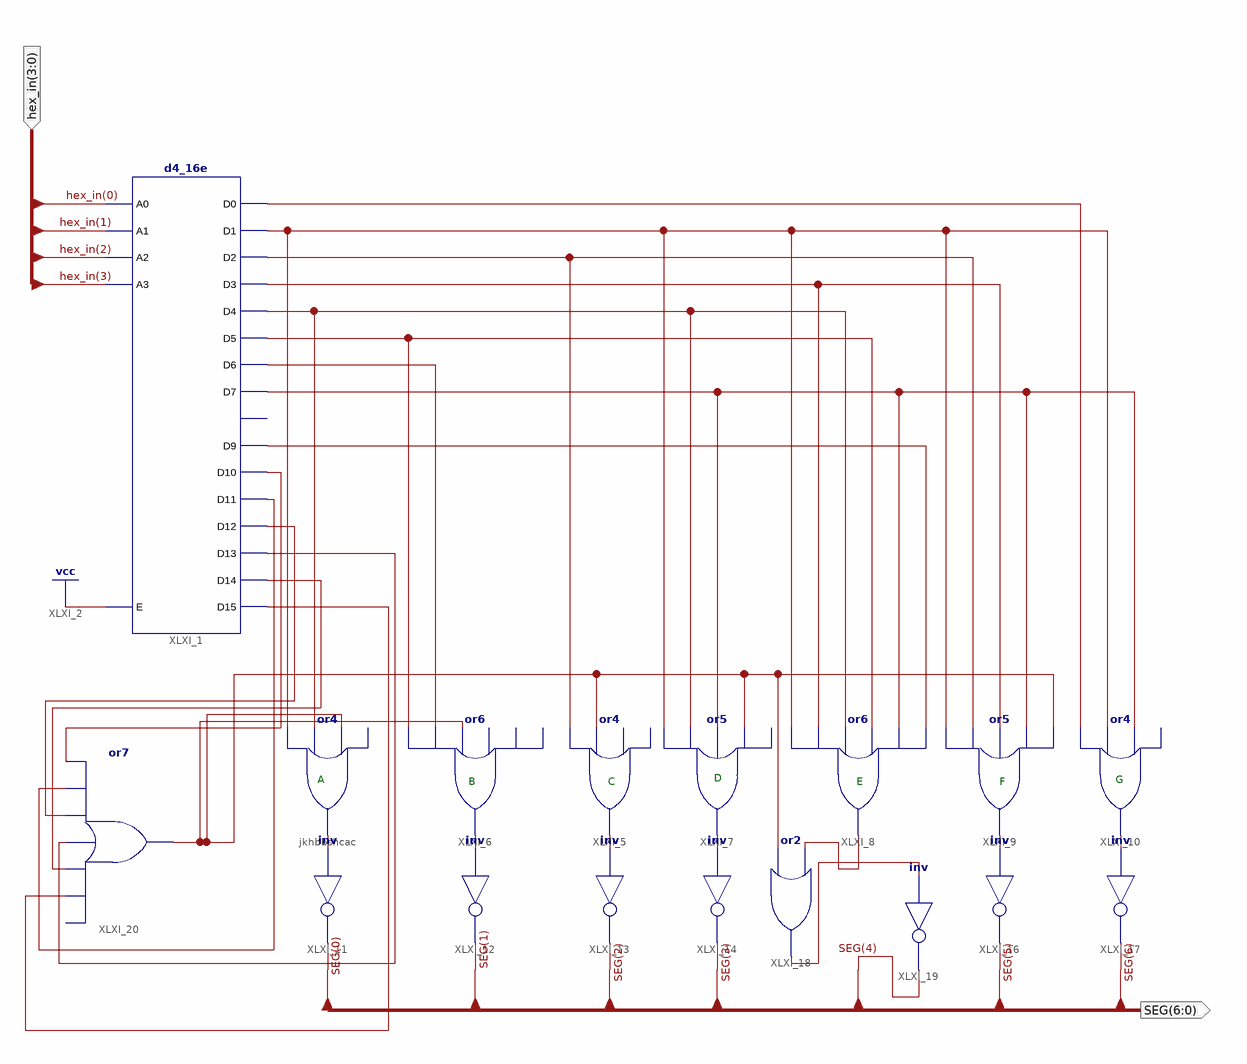
[diagram p0: schematic sheet 1]
// Xilinx ISE schematic HEX2SEG.sch (spartan6) as structural Verilog: 17 symbols, 2 ports
module HEX2SEG (
  input  [3:0] hex_in,
  output [6:0] SEG
);

  wire XLXN_3, XLXN_4, XLXN_5, XLXN_6, XLXN_7, XLXN_8, XLXN_10, XLXN_11, XLXN_12, XLXN_20, XLXN_21, XLXN_22,
       XLXN_23, XLXN_25, XLXN_26, XLXN_27, XLXN_28, XLXN_29, XLXN_30, XLXN_31, XLXN_32, XLXN_33, XLXN_34,
       XLXN_40;

  d4_16e XLXI_1 (
    .A0(hex_in[0]), .A1(hex_in[1]), .A2(hex_in[2]), .A3(hex_in[3]), .E(1'b1), .D0(XLXN_3), .D1(XLXN_4),
    .D10(XLXN_29), .D11(XLXN_30), .D12(XLXN_31), .D13(XLXN_32), .D14(XLXN_33), .D15(XLXN_34), .D2(XLXN_5),
    .D3(XLXN_6), .D4(XLXN_7), .D5(XLXN_12), .D6(XLXN_11), .D7(XLXN_10), .D9(XLXN_8));  // open: D8
  or jkhbbshcac (XLXN_20, XLXN_4, XLXN_7, XLXN_40);  // open: I3
  or XLXI_6 (XLXN_21, XLXN_12, XLXN_11, XLXN_40);  // open: I3, I4, I5
  or XLXI_5 (XLXN_22, XLXN_5, XLXN_40);  // open: I2, I3
  or XLXI_7 (XLXN_23, XLXN_4, XLXN_7, XLXN_10, XLXN_40);  // open: I4
  or XLXI_8 (XLXN_28, XLXN_4, XLXN_6, XLXN_7, XLXN_12, XLXN_10, XLXN_8);
  or XLXI_9 (XLXN_25, XLXN_4, XLXN_5, XLXN_6, XLXN_10, XLXN_40);
  or XLXI_10 (XLXN_26, XLXN_3, XLXN_4, XLXN_10);  // open: I3
  not XLXI_11 (SEG[0], XLXN_20);
  not XLXI_12 (SEG[1], XLXN_21);
  not XLXI_13 (SEG[2], XLXN_22);
  not XLXI_14 (SEG[3], XLXN_23);
  not XLXI_16 (SEG[5], XLXN_25);
  not XLXI_17 (SEG[6], XLXN_26);
  or XLXI_18 (XLXN_27, XLXN_40, XLXN_28);
  not XLXI_19 (SEG[4], XLXN_27);
  or XLXI_20 (XLXN_40, XLXN_34, XLXN_33, XLXN_32, XLXN_31, XLXN_30, XLXN_29);  // open: I0

  // Notes on the sheet:
  //   D
  //   A
  //   G
  //   B
  //   C
  //   E
  //   F
endmodule
